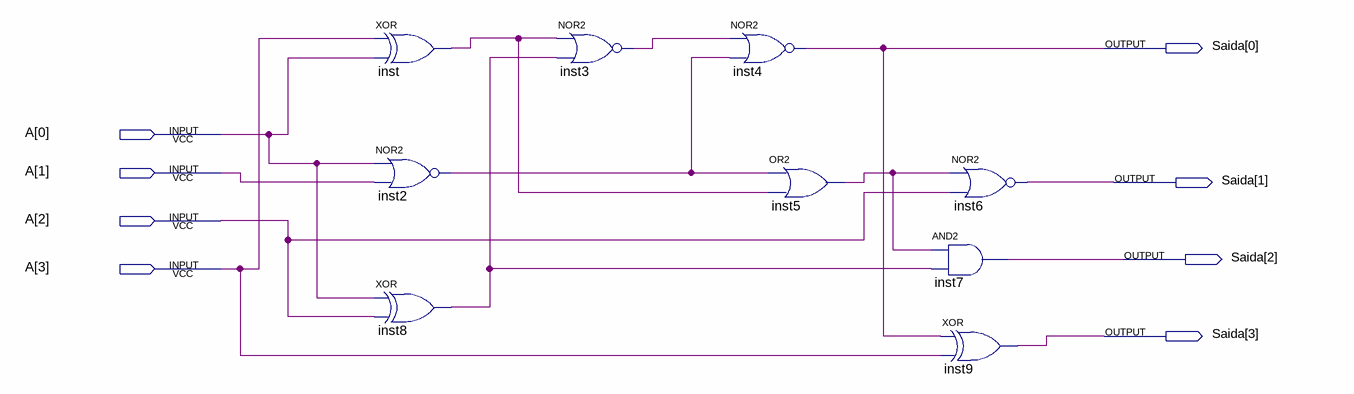
[diagram p0: schematic sheet]
// Quartus schematic Dabble.bdf as structural Verilog: 9 symbols, 8 pins
module Dabble (
  input  [3:0] A,
  output [3:0] Saida
);

  wire inst2_out, inst3_out, inst5_out, inst8_out, inst_out;

  xor inst (inst_out, A[3], A[0]);
  nor inst2 (inst2_out, A[0], A[1]);
  xor inst8 (inst8_out, A[0], A[2]);
  nor inst3 (inst3_out, inst_out, inst8_out);
  nor inst4 (Saida[0], inst3_out, inst2_out);
  or inst5 (inst5_out, inst2_out, inst_out);
  and inst7 (Saida[2], inst5_out, inst8_out);
  nor inst6 (Saida[1], inst5_out, A[2]);
  xor inst9 (Saida[3], Saida[0], A[3]);
endmodule
